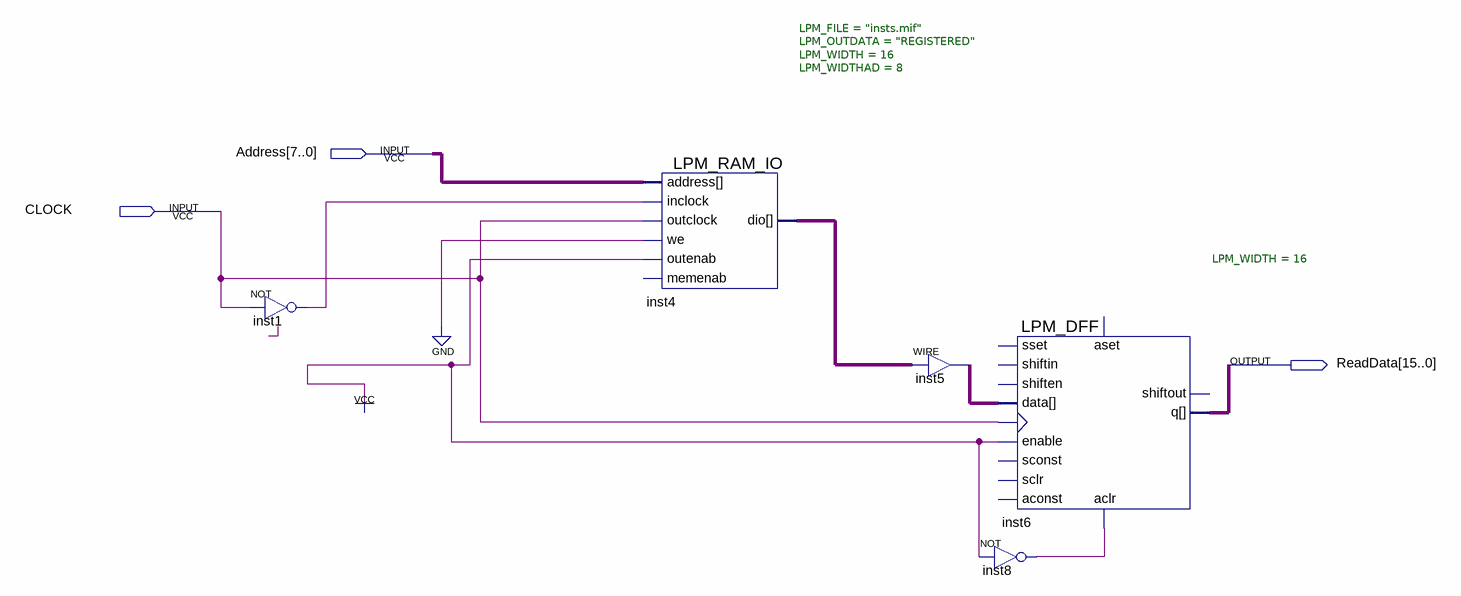
[diagram p0: schematic sheet]
// Quartus schematic InstructionMemory.bdf as structural Verilog: 5 symbols, 3 pins
module InstructionMemory (
  input  [7:0] Address,
  input  CLOCK,
  output [15:0] ReadData
);

  wire inst1_out, inst8_out;
  wire [15:0] inst4_dio, inst5_out;

  not inst1 (inst1_out, CLOCK);
  LPM_RAM_IO #(.LPM_FILE("insts.mif"), .LPM_OUTDATA("REGISTERED"), .LPM_WIDTH(16), .LPM_WIDTHAD(8)) inst4 (
    .address(Address), .outclock(CLOCK), .inclock(inst1_out), .we(1'b0), .outenab(1'b1), .dio(inst4_dio));  // open: memenab
  assign inst5_out = inst4_dio;  // WIRE inst5
  LPM_DFF #(.LPM_WIDTH(16)) inst6 (
    .enable(1'b1), .clock(CLOCK), .data(inst5_out), .aclr(inst8_out), .q(ReadData));  // open: shiftin, shiften, aconst, sclr, sconst, sset, aset, shiftout
  not inst8 (inst8_out, 1'b1);
endmodule
